# EAGLE design Adafruit TCA4307 (EAGLE 9.6.2)
AUTHOR: BRYAN; COMPANY: ADAFRUIT INDUSTRIES; REV: A
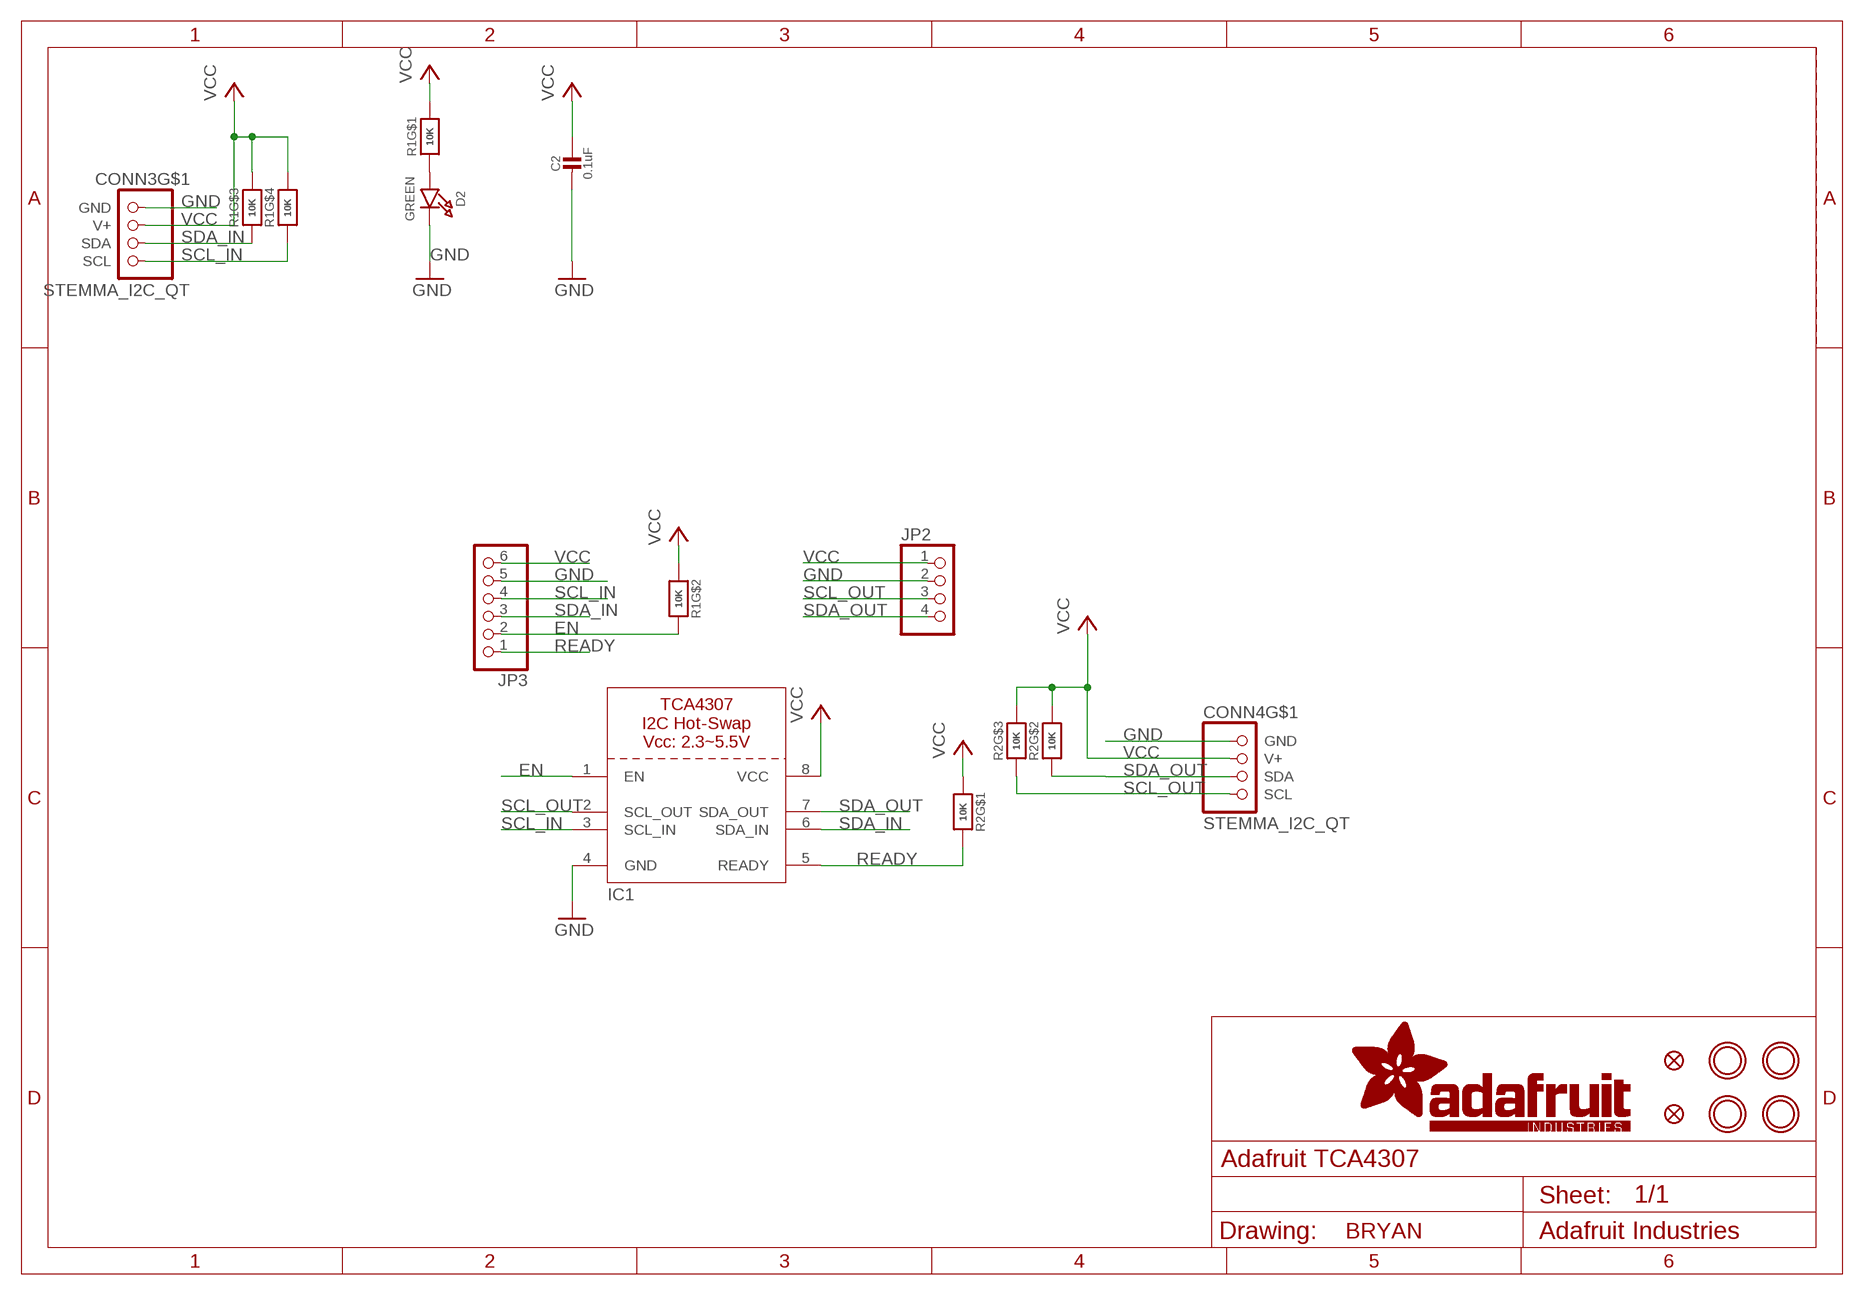
[diagram p0: schematic, sheet 1]

## Parts
C2  0.1uF  CAP_CERAMIC0603_NO  [0603-NO]
CONN3  STEMMA_I2C_QT  [JST_SH4]
CONN4  STEMMA_I2C_QT  [JST_SH4]
D2  GREEN  LED0603_NOOUTLINE  [CHIPLED_0603_NOOUTLINE]
FID3  FIDUCIAL_1MM  [FIDUCIAL_1MM]
FID4  FIDUCIAL_1MM  [FIDUCIAL_1MM]
IC1  TCA4307  [TSSOP8]
JP2  HEADER-1X4ROUND  [1X04_ROUND]
JP3  HEADER-1X670MIL  [1X06_ROUND_70]
R1  10K  RESISTOR_4PACK  [RESPACK_4X0603]
R2  10K  RESISTOR_4PACK  [RESPACK_4X0603]
U$1  MOUNTINGHOLE2.5  [MOUNTINGHOLE_2.5_PLATED]
U$17  MOUNTINGHOLE2.5  [MOUNTINGHOLE_2.5_PLATED]
U$19  MOUNTINGHOLE2.5  [MOUNTINGHOLE_2.5_PLATED]
U$21  MOUNTINGHOLE2.5  [MOUNTINGHOLE_2.5_PLATED]

## Nets
EN: IC1.1(EN) JP3.2 R1.7
GND: C2.2 CONN3.1(GND) CONN4.1(GND) D2.C IC1.4(GND) JP2.2 JP3.5
N$1: D2.A R1.1
READY: IC1.5(READY) JP3.1 R2.8
SCL_IN: CONN3.4(SCL) IC1.3(SCL_IN) JP3.4 R1.4
SCL_OUT: CONN4.4(SCL) IC1.2(SCL_OUT) JP2.3 R2.3
SDA_IN: CONN3.3(SDA) IC1.6(SDA_IN) JP3.3 R1.3
SDA_OUT: CONN4.3(SDA) IC1.7(SDA_OUT) JP2.4 R2.2
VCC: C2.1 CONN3.2(V+) CONN4.2(V+) IC1.8(VCC) JP2.1 JP3.6 R1.2 R1.5 R1.6 R1.8 R2.1 R2.6 R2.7
Unconnected: CONN3.MT1(MT) CONN3.MT2(MT) CONN4.MT1(MT) CONN4.MT2(MT) R2.4 R2.5

## Library data of the parts
C2 = microbuilder:CAP_CERAMIC: Ceramic Capacitors For new designs, use the packages preceded by an '_' character since they are more reliable: The following footprints should be used on most boards: _0402 - Standard footprint for regular board layouts _0603 - Standard footprint for regular board layouts _0805 - Standard footprint for regular board layouts _1206 - Standard footprint for regular board layouts For extremely tight-pitch boards where space is at a premium, the following 'micro-pitch' footprints can be used (smaller pads, no silkscreen outline, etc.): _0402MP - Micro-pitch footprint for very dense/compact boards _0603MP - Micro-pitch footprint for very dense/compact boards _0805MP - Micro-pitch footprint for very dense/compact boards _1206MP - Micro-pitch footprint for very dense/compact boards
CONN3 CONN4 = microbuilder:STEMMA_I2C
D2 = microbuilder:LED: LED 0603 - 0603 Surface Mount Package 2mA: Green LED - Low Power (3.9mcd, 2ma, 1.7Vf) - Digikey: 475-2709-2-ND Orange LED - Low Power (9.8mcd, 2ma, 1.8Vf) - Digikey: 475-1194-2-ND Red LED - Low Power (5mcd, 2ma, 1.8Vf) - Digikey: 475-1195-2-ND Yellow LED - Low Power (7mcd, 2ma, 1.8Vf) - Digikey: 475-1196-2-ND 5mA: Blue LED - Low Power (17mcd, 5ma, 2.9Vf) - Digikey: LNJ937W8CRACT-ND 0805 - 0805 Surface Mount Package 2mA: Red LED (8.8mcd, 2mA, 1.8Vf, Clear) - Low Power [Digikey: 475-2510-1-ND] Green LED (5mcd, 2mA, 1.8Vf, Clear) - Low Power [Digikey: 475-2730-1-ND] Yellow LED (11.3mcd, 2mA, 1.8Vf, Clear) - Low Power [Digikey: 475-2555-1-ND] 20mA: Red LED (104mcd, 20mA, Diffused) - LS R976 [Digikey: 475-1278-6-ND] Red LED (12mcd, 20mA, 2.0Vf, Clear) - APT2012EC [Digikey: 754-1128-1-ND] Green LED (15mcd, 20mA, 2.2Vf, Clear) - APT2012GC [Digikey: 754-1131-1-ND] Orange LED (160mcd, 20mA, 2.1Vf, Clear) - APT2012SECK [Digikey: 754-1130-1-ND] 1206 - 1206 Surface Mount Package Green LED (26mcd, 20mA, Diffused) - LG N971 [Digikey: 475-1407-6-ND] Red LED (15mcd, 20mA, Diffused) - LH N974 [Digikey: 475-1416-6-ND] Cree - Cree High-Power Surface Mount LEDs XPEBWT-L1-0000-00D50 - White 111lm 350mA 2.9Vf 6200K 110° XTEAWT-00-0000-00000LEE3 - White 114lm 350mA 2.85Vf 5000K 115° Everlight - Everlight 45-21 Series Surface Mount LEDs 45-21/QK2C-B2832AC2CB2/2T - Warm White 2000mcd 20mA 3.25Vf 3050K 120° 45-21/LK2C-B38452C4CB2/2T - Nuetral White 2000mcd 20mA 3.25Vf 4150K 120° 45-21/LK2C-B50634C6CB2/2T - Cold White 2200mcd 20mA 3.25Vf 5650K 120° PLCC2 Reverse Mount LS T77K-J1L2-1-0-2-R18-Z - Red 11.25mcd 2mA 1.8Vf 630nm 120° LO T77K-L1M2-24-Z - Orange 19.6mcd 2mA 1.8Vf 606nm 120° LY T77K-K2M1-26-Z - Yellow 15.7mcd 2mA 1.8Vf 587nm 120°
FID3 FID4 = microbuilder:FIDUCIAL: Fiducial Alignment Points Various fiducial points for machine vision alignment.; BOM: EXCLUDE
IC1 = microbuilder:TCA4307
JP2 = microbuilder:HEADER-1X4: PIN HEADER
JP3 = microbuilder:HEADER-1X6: PIN HEADER
R1 R2 = microbuilder:RESISTOR_4PACK: Resistor Packs (4 resistors) 4 x 0603 10K 1/16W - Digikey: YC164J-10KCT-ND
U$1 U$17 U$19 U$21 = microbuilder:MOUNTINGHOLE: Mounting Hole For #2 screws (0.086"/2.18mm width, 0.094"/2.4mm hole) use 2.5mm; BOM: EXCLUDE

## Net classes
1 highpower: width 0.406 mm, drill 0.483 mm
2 lowpower: width 0.305 mm, drill 0.483 mm

## Board
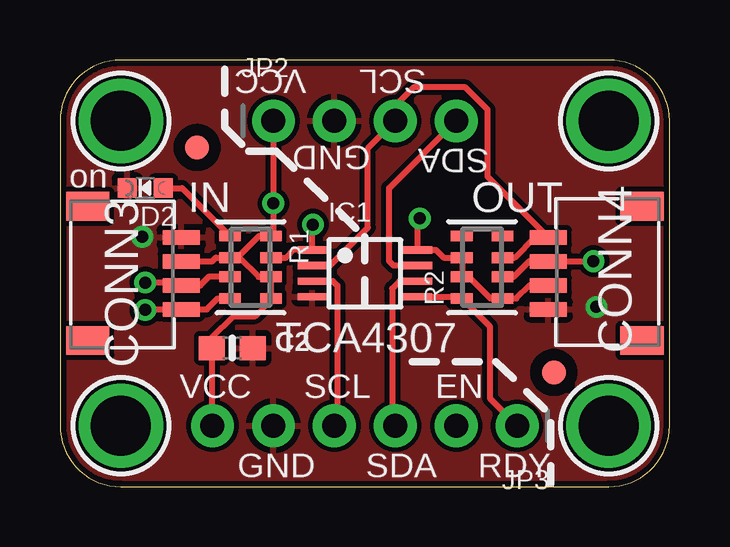
[diagram p1: board, top side]
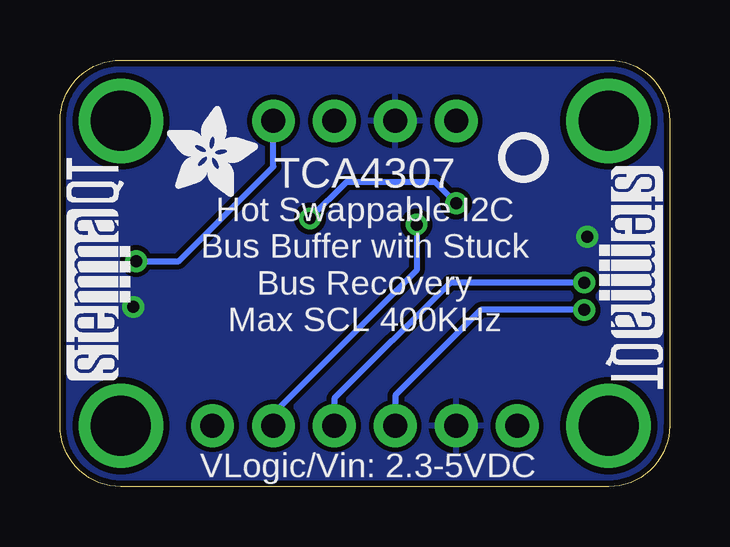
[diagram p2: board, bottom side, seen from below]

Size 25.4 x 17.78 mm. Coordinates in mm from the lower left corner, seen from the top.
Outline: 0,15.24 0,2.54 arc90 2.54,0 22.86,0 arc90 25.4,2.54 25.4,15.24 arc90 22.86,17.78 2.54,17.78 arc90 0,15.24
Copper layers (1*16): Top 0.035mm / dielectric 1.5mm / Bottom 0.035mm
Design rules "adafruit *": minimum track width 8mil, minimum drill 15.5mil, track to track 8mil, track to pad 8mil, pad to pad 8mil, via to via 8mil, smd to smd 8mil, copper to edge 10mil, drill to drill 8mil, minimum pad ring 10mil, minimum via ring 8mil, stop-mask expansion 2mil, vias tented up to drill 20mil, thermal gap 10mil

### Footprints (pad centres in the part's own frame; a part is rotated, then mirrored left to right if it is on the bottom)
0603-NO = smd 1.075 x 1: 1 -0.85,0; 2 0.85,0
JST_SH4 = smd 0.6 x 1.55: 1 -1.5,2.514; 2 -0.5,2.514; 3 0.5,2.514; 4 1.5,2.514 | smd 1.2 x 1.8: MT1 -2.8,-1.386; MT2 2.8,-1.386
CHIPLED_0603_NOOUTLINE = smd 0.8 x 0.8: A 0,-0.75; C 0,0.75
FIDUCIAL_1MM = smd 1 x 1: 1 0,0
TSSOP8 = smd 1.2 x 0.305: 1 -2.2,0.975; 2 -2.2,0.325; 3 -2.2,-0.325; 4 -2.2,-0.975; 5 2.2,-0.975; 6 2.2,-0.325; 7 2.2,0.325; 8 2.2,0.975
1X04_ROUND = drill 1 pad 1.778: 1 -3.81,0; 2 -1.27,0; 3 1.27,0; 4 3.81,0
1X06_ROUND_70 = drill 1 pad 1.778: 1 -6.35,0; 2 -3.81,0; 3 -1.27,0; 4 1.27,0; 5 3.81,0; 6 6.35,0
RESPACK_4X0603 = smd 0.45 x 0.9: 1 -1.3,-0.85; 2 -0.4,-0.85; 3 0.4,-0.85; 4 1.3,-0.85; 5 1.3,0.85; 6 0.4,0.85; 7 -0.4,0.85; 8 -1.3,0.85
MOUNTINGHOLE_2.5_PLATED = drill 2.5 pad 3.2: P$1 0,0

### Placement (x,y rotation side)
C2  7.18,5.78 0 top
CONN3  2.54,8.89 270 top
CONN4  22.86,8.89 90 top
D2  3.56,12.45 90 top
FID3  20.57,4.76 0 top
FID4  5.71,14.14 0 top
IC1  12.7,8.89 0 top
JP2  12.7,15.24 0 top
JP3  12.7,2.54 180 top
R1  7.94,9.14 270 top
R2  17.59,9.14 90 top
U$1  2.54,15.24 0 top
U$2  [ADAFRUIT_3.5MM]  20.95,12.06 0 bottom
U$17  22.86,15.24 0 top
U$19  2.54,2.54 0 top
U$21  22.86,2.54 0 top
U$25  [PCBFEAT-REV-040]  6.1,13.72 0 bottom
U$30  [STEMMAQT]  22.48,4.45 90 bottom
U$31  [STEMMAQT]  2.92,13.34 270 bottom

### Tracks (layer width: path | path; a pad name or v marks a point on that pad's centre or on a via)
EN  (via drill 0.5)
  Top 0.254: R1.7 8.81,9.53 9.4,9.53 9.74,9.87 IC1.1 10.5,10.88 v10.54,10.92
  Bottom 0.254: v10.54,10.92 10.54,9.02 16.51,3.05 JP3.2
GND  (via drill 0.5)
  other vias: 3.43,10.41 22.35,7.49
  pour Top: 0,17.78 25.4,17.78 25.4,0 0,0
  pour Bottom: 0,17.78 25.4,17.78 25.4,0 0,0
N$1
  Top 0.254: D2.A 5.08,12.45 R1.1
READY
  Top 0.254: IC1.5 16.67,7.92 R2.8 17.91,6.68 17.91,3.68 JP3.1
SCL_IN  (via drill 0.5)
  Top 0.254: IC1.3 11.37,8.56 11.56,8.38 11.56,2.67 JP3.4 | R1.4 6.57,7.84 6.12,7.39 CONN3.4 5.03,7.37 v3.56,7.37
  Bottom 0.254: v3.56,7.37 7.87,7.37 11.43,3.81 JP3.4
SCL_OUT
  Top 0.254: IC1.2 11.25,9.21 12.83,10.79 12.83,14.1 JP2.3 13.97,15.88 14.73,16.64 16.89,16.64 17.81,15.72 17.81,12.93 CONN4.4 19.79,10.39 18.94,9.54 R2.3
SDA_IN  (via drill 0.5)
  Top 0.254: IC1.6 14.15,8.56 13.84,8.26 13.84,2.67 JP3.3 | R1.3 7.07,8.76 6.22,8.76 5.85,8.39 CONN3.3 4.93,8.51 v3.56,8.51
  Bottom 0.254: v3.56,8.51 9.14,8.51 13.97,3.68 JP3.3
SDA_OUT  (via drill 0.5)
  Top 0.254: IC1.7 13.9,9.21 13.72,9.4 13.72,12.45 JP2.4 | R2.2 18.9,8.74 19.56,9.4 20.34,9.4 CONN4.3 22.22,9.39 v22.23,9.4
  Bottom 0.254: v22.23,9.4 20.45,9.4 16.51,13.34 JP2.4
VCC  (via drill 0.5)
  Top 0.254: CONN3.2 6.34,9.39 6.5,9.54 R1.2 | R1.2 7.47,9.54 8.27,8.74 R1.6 R1.5 8.79,7.77 8.13,7.11 7.24,7.11 6.33,6.2 C2.1 6.33,2.56 JP3.6 | R1.2 7.38,9.54 8.29,10.44 R1.8 8.89,10.55 v8.89,11.81 JP2.1 | CONN4.2 19.57,8.39 19.02,7.84 R2.1 17.94,7.84 17.04,8.74 16.76,8.74 | R2.7 16.76,8.74 | 16.76,8.74 16.76,9.52 R2.6 15.98,9.54 15.66,9.87 IC1.8 14.9,11.09 v14.99,11.18
  Bottom 0.254: v14.99,11.18 13.46,12.7 9.78,12.7 v8.89,11.81

### Text on the board
tPlace: VCC | SCL | GND | SDA | on | IN | OUT | TCA4307 | VCC | SCL | EN | GND | SDA | RDY
bPlace: TCA4307 | Hot Swappable I2C / Bus Buffer with Stuck / Bus Recovery / Max SCL 400KHz | VLogic/Vin: 2.3-5VDC